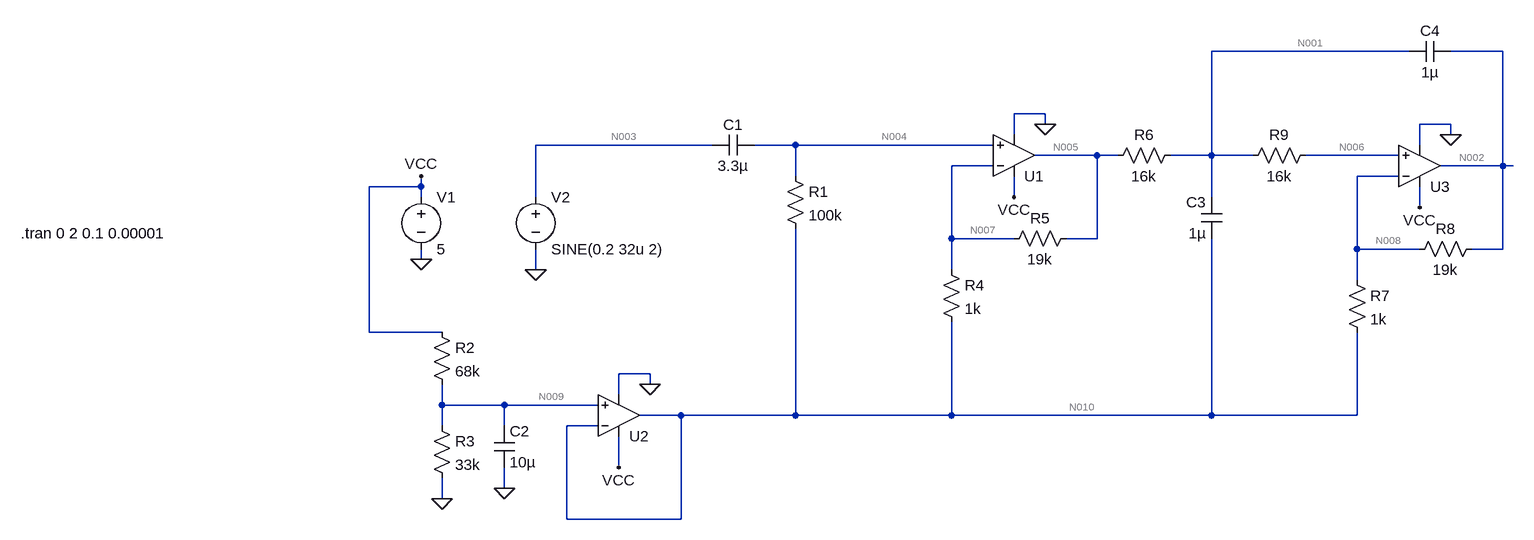
[diagram p0: schematic Draft2.asc]
Draft2.asc, the LTspice schematic file:
Version 4.1
SHEET 1 1908 680
WIRE 1520 -192 1216 -192
WIRE 1664 -192 1584 -192
WIRE 960 -96 912 -96
WIRE 960 -80 960 -96
WIRE 1584 -80 1536 -80
WIRE 912 -64 912 -96
WIRE 1584 -64 1584 -80
WIRE 448 -48 176 -48
WIRE 576 -48 512 -48
WIRE 880 -48 576 -48
WIRE 1536 -48 1536 -80
WIRE 1040 -32 944 -32
WIRE 1072 -32 1040 -32
WIRE 1216 -32 1216 -192
WIRE 1216 -32 1152 -32
WIRE 1280 -32 1216 -32
WIRE 1504 -32 1360 -32
WIRE 880 -16 816 -16
WIRE 1664 -16 1664 -192
WIRE 1664 -16 1568 -16
WIRE 1680 -16 1664 -16
WIRE 576 0 576 -48
WIRE 1504 0 1440 0
WIRE 0 16 0 0
WIRE 0 16 -80 16
WIRE 0 32 0 16
WIRE 176 32 176 -48
WIRE 912 32 912 0
WIRE 1216 32 1216 -32
WIRE 1536 48 1536 16
WIRE 816 96 816 -16
WIRE 912 96 816 96
WIRE 1040 96 1040 -32
WIRE 1040 96 992 96
WIRE 1440 112 1440 0
WIRE 1536 112 1440 112
WIRE 1664 112 1664 -16
WIRE 1664 112 1616 112
WIRE 0 128 0 112
WIRE 176 144 176 112
WIRE 816 144 816 96
WIRE 1440 160 1440 112
WIRE -80 240 -80 16
WIRE 32 240 -80 240
WIRE 352 304 304 304
WIRE 352 320 352 304
WIRE 304 336 304 304
WIRE 32 352 32 320
WIRE 128 352 32 352
WIRE 272 352 128 352
WIRE 400 368 336 368
WIRE 576 368 576 80
WIRE 576 368 400 368
WIRE 816 368 816 224
WIRE 816 368 576 368
WIRE 1216 368 1216 96
WIRE 1216 368 816 368
WIRE 1440 368 1440 240
WIRE 1440 368 1216 368
WIRE 32 384 32 352
WIRE 128 384 128 352
WIRE 272 384 224 384
WIRE 304 448 304 400
WIRE 128 480 128 448
WIRE 32 496 32 464
WIRE 224 528 224 384
WIRE 400 528 400 368
WIRE 400 528 224 528
FLAG 0 128 0
FLAG 0 0 VCC
FLAG 176 144 0
FLAG 32 496 0
FLAG 128 480 0
FLAG 960 -80 0
FLAG 912 32 VCC
FLAG 352 320 0
FLAG 304 448 VCC
FLAG 1584 -64 0
FLAG 1536 48 VCC
SYMBOL voltage 0 16 R0
WINDOW 123 0 0 Left 0
WINDOW 39 0 0 Left 0
SYMATTR InstName V1
SYMATTR Value 5
SYMBOL OpAmps\\UniversalOpAmp2 912 -32 M180
SYMATTR InstName U1
SYMBOL voltage 176 16 R0
WINDOW 123 0 0 Left 0
WINDOW 39 0 0 Left 0
SYMATTR InstName V2
SYMATTR Value SINE(0.2 32u 2)
SYMBOL cap 512 -64 R90
WINDOW 0 0 32 VBottom 2
WINDOW 3 32 32 VTop 2
SYMATTR InstName C1
SYMATTR Value 3.3µ
SYMBOL res 560 -16 R0
SYMATTR InstName R1
SYMATTR Value 100k
SYMBOL res 16 224 R0
SYMATTR InstName R2
SYMATTR Value 68k
SYMBOL res 16 368 R0
SYMATTR InstName R3
SYMATTR Value 33k
SYMBOL cap 112 384 R0
SYMATTR InstName C2
SYMATTR Value 10µ
SYMBOL res 800 128 R0
SYMATTR InstName R4
SYMATTR Value 1k
SYMBOL res 1008 80 R90
WINDOW 0 0 56 VBottom 2
WINDOW 3 32 56 VTop 2
SYMATTR InstName R5
SYMATTR Value 19k
SYMBOL OpAmps\\UniversalOpAmp2 304 368 M180
SYMATTR InstName U2
SYMBOL OpAmps\\UniversalOpAmp2 1536 -16 M180
SYMATTR InstName U3
SYMBOL res 1424 144 R0
SYMATTR InstName R7
SYMATTR Value 1k
SYMBOL res 1632 96 R90
WINDOW 0 0 56 VBottom 2
WINDOW 3 32 56 VTop 2
SYMATTR InstName R8
SYMATTR Value 19k
SYMBOL cap 1232 96 R180
WINDOW 0 24 56 Left 2
WINDOW 3 24 8 Left 2
SYMATTR InstName C3
SYMATTR Value 1µ
SYMBOL res 1168 -48 R90
WINDOW 0 0 56 VBottom 2
WINDOW 3 32 56 VTop 2
SYMATTR InstName R6
SYMATTR Value 16k
SYMBOL res 1376 -48 R90
WINDOW 0 0 56 VBottom 2
WINDOW 3 32 56 VTop 2
SYMATTR InstName R9
SYMATTR Value 16k
SYMBOL cap 1520 -176 R270
WINDOW 0 32 32 VTop 2
WINDOW 3 0 32 VBottom 2
SYMATTR InstName C4
SYMATTR Value 1µ
TEXT -616 88 Left 2 !.tran 0 2 0.1 0.00001

The netlist it stands for:
* Draft2.asc
V1 VCC 0 5
X§U1 N004 N007 VCC 0 N005 level2 Avol=1Meg GBW=10Meg Slew=10Meg Ilimit=25m Rail=0 Vos=0 En=0 Enk=0 In=0 Ink=0 Rin=500Meg  ; pins In+ In- V+ V- OUT
V2 N003 0 SINE(0.2 32u 2)
C1 N004 N003 3.3µ
R1 N004 N010 100k
R2 VCC N009 68k
R3 N009 0 33k
C2 N009 0 10µ
R4 N007 N010 1k
R5 N005 N007 19k
X§U2 N009 N010 VCC 0 N010 level2 Avol=1Meg GBW=10Meg Slew=10Meg Ilimit=25m Rail=0 Vos=0 En=0 Enk=0 In=0 Ink=0 Rin=500Meg  ; pins In+ In- V+ V- OUT
X§U3 N006 N008 VCC 0 N002 level2 Avol=1Meg GBW=10Meg Slew=10Meg Ilimit=25m Rail=0 Vos=0 En=0 Enk=0 In=0 Ink=0 Rin=500Meg  ; pins In+ In- V+ V- OUT
R7 N008 N010 1k
R8 N002 N008 19k
C3 N010 N001 1µ
R6 N001 N005 16k
R9 N006 N001 16k
C4 N001 N002 1µ
.tran 0 2 0.1 0.00001
.lib UniversalOpAmp2.lib
.backanno
.end

* Results of the author's LTspice run, read from the files saved beside the schematic
* Operating Point, zero values left out:
*   V(n001) = 1.637 V
*   V(n002) = 1.704 V
*   V(n003) = 200 mV
*   V(n004) = 1.634 V
*   V(n005) = 1.637 V
*   V(n006) = 1.637 V
*   V(n007) = 1.634 V
*   V(n008) = 1.637 V
*   V(n009) = 1.634 V
*   V(n010) = 1.634 V
*   V(vcc) = 5 V
*   I(R1) = 1.732 nA
*   I(R2) = 49.5 µA
*   I(R3) = 49.51 µA
*   I(R4) = 174.1 nA
*   I(R5) = 172.4 nA
*   I(R6) = 1.726 nA
*   I(R7) = 3.505 µA
*   I(R8) = 3.503 µA
*   I(R9) = 1.726 nA
*   I(V1) = -755.7 µA
*   Ix(u1:1) = -1.732 nA
*   Ix(u1:2) = -1.732 nA
*   Ix(u1:3) = 234.7 µA
*   Ix(u1:4) = -234.6 µA
*   Ix(u1:5) = -170.6 nA
*   Ix(u2:1) = -1.733 nA
*   Ix(u2:2) = -1.733 nA
*   Ix(u2:3) = 232.7 µA
*   Ix(u2:4) = -236.4 µA
*   Ix(u2:5) = 3.683 µA
*   Ix(u3:1) = -1.726 nA
*   Ix(u3:2) = -1.726 nA
*   Ix(u3:3) = 238.8 µA
*   Ix(u3:4) = -235.2 µA
*   Ix(u3:5) = -3.503 µA
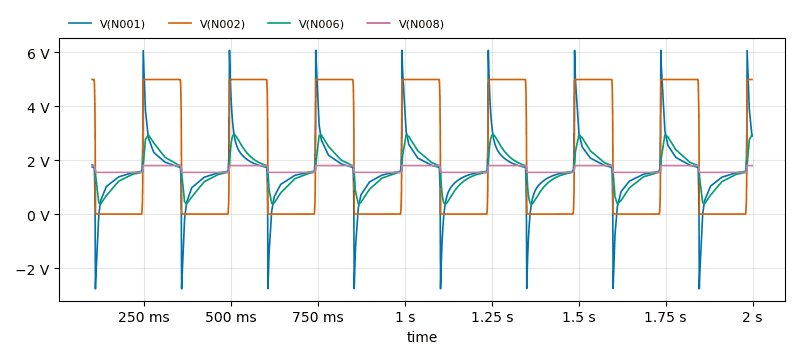
[diagram p1: Transient Analysis of Draft2.asc, plotted from the saved traces]
* Transient Analysis, 1 run:
*   V(N001): min -2.772 V, max 6.078 V, average 1.619 V, rms 1.897 V, last 2.776 V
*   V(N002): min 889.8 µV, max 4.998 V, average 2.106 V, rms 3.23 V, last 4.998 V
*   V(N006): min 374.7 mV, max 2.953 V, average 1.61 V, rms 1.749 V, last 2.939 V
*   V(N008): min 1.552 V, max 1.802 V, average 1.657 V, rms 1.662 V, last 1.802 V